# EAGLE schematic lb_rb (EAGLE 6.5.0)
AUTHOR: Neal Jackson; REV: A; TITLE: BMO LB/RB
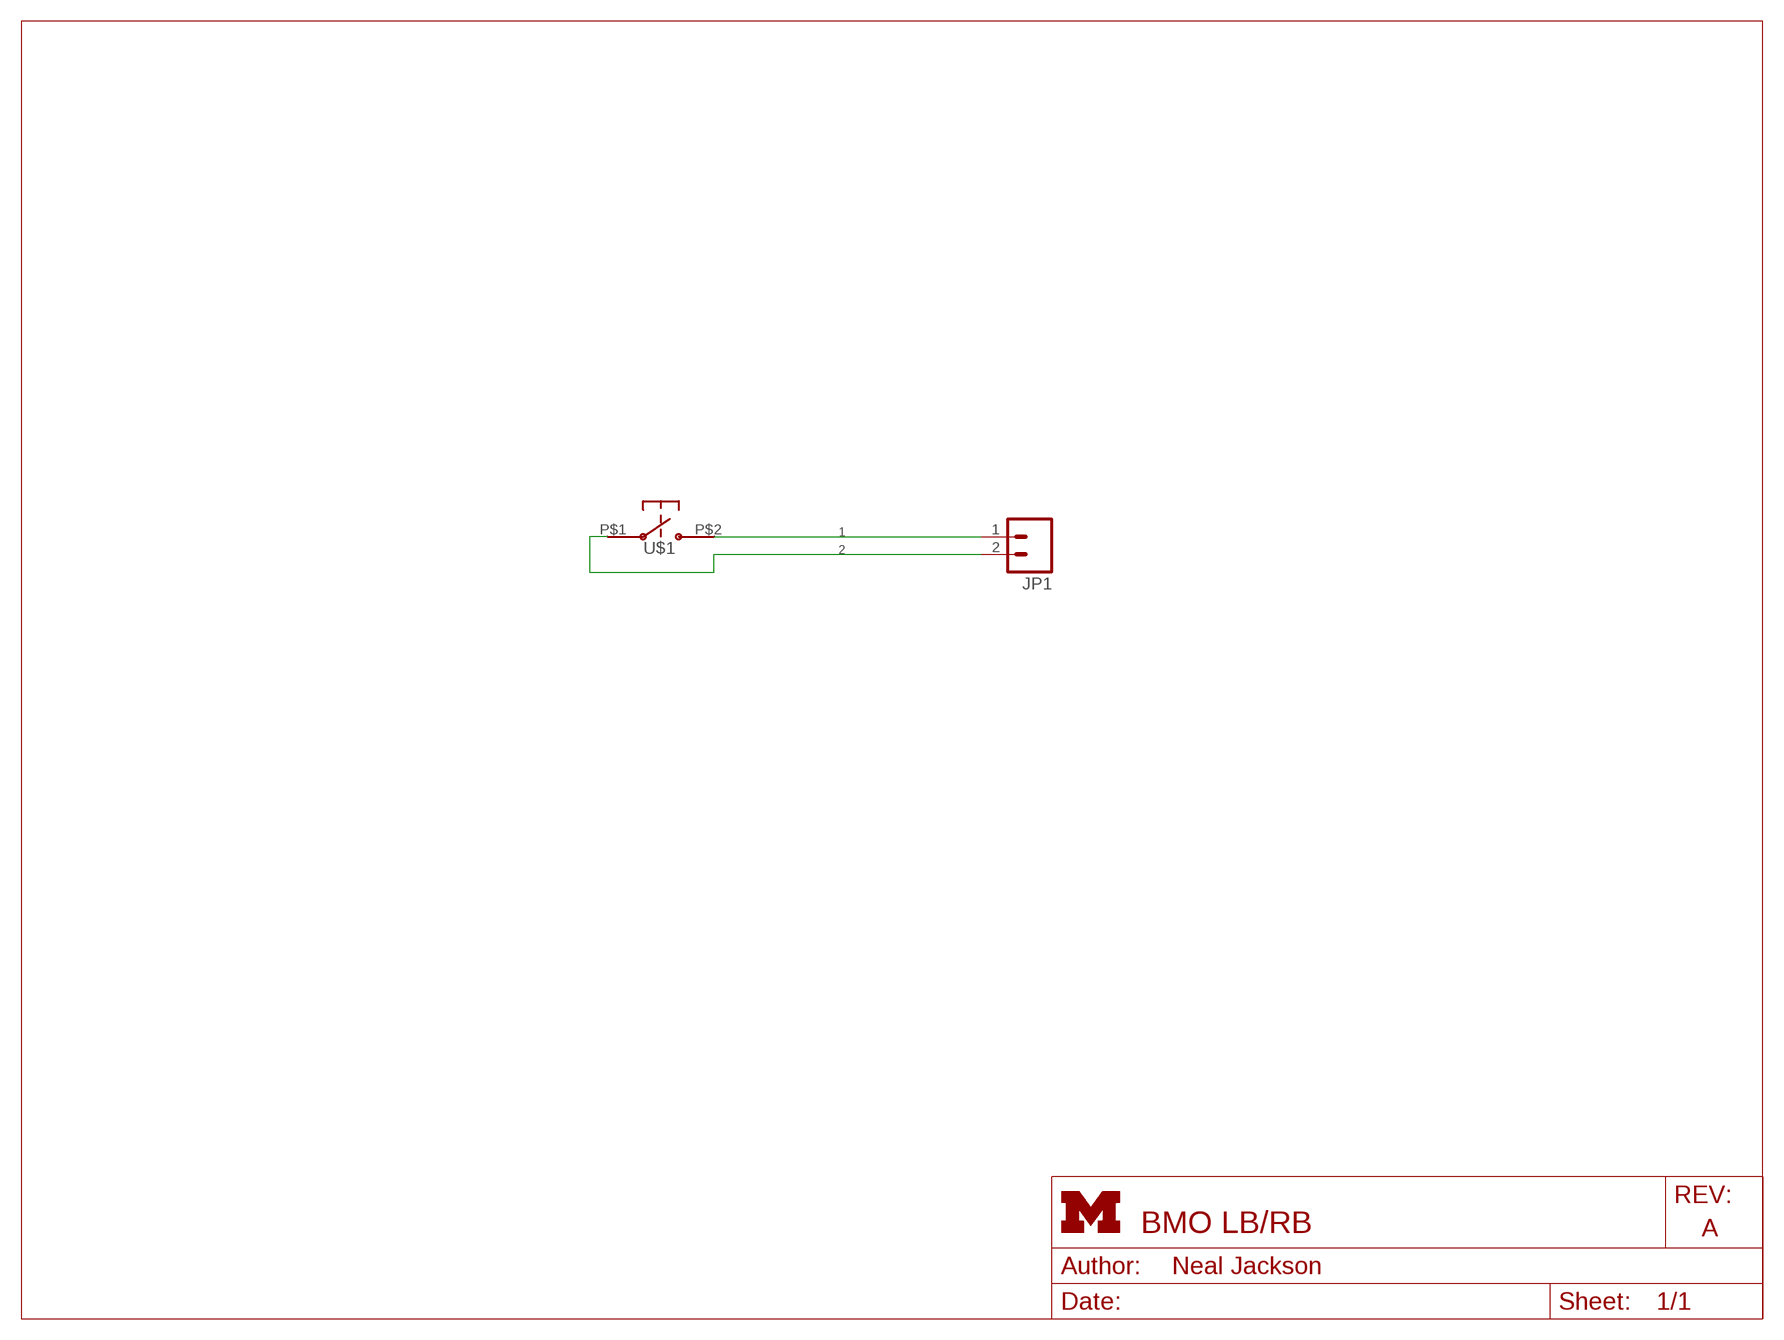
[diagram p0: schematic, sheet 1]
FRAME1 (LETTER_L): HEIGHT: 8.5in; WIDTH: 11in

## Parts
JP1  M02PTH  [1X02]
U$1  SKPDAMD010  [SKPDAMD010]

## Nets
1: JP1.1 U$1.P$2
2: JP1.2 U$1.P$1

## Library data of the parts
JP1 = SparkFun-Connectors:M02: Header 2 Standard 2-pin 0.1" header. Use with straight break away headers (SKU : PRT-00116), right angle break away headers (PRT-00553), swiss pins (PRT-00743), machine pins (PRT-00117), and female headers (PRT-00115). Molex polarized connector foot print use with SKU : PRT-08233 with associated crimp pins and housings.
U$1 = BMO:SKPDAMD010; MOUSER: 688-SKPDAM